# Altium schematic sheet Connector-Sheet.SchDoc
size A; DocumentNumber: 5; SheetNumber: 5; SheetTotal: 5
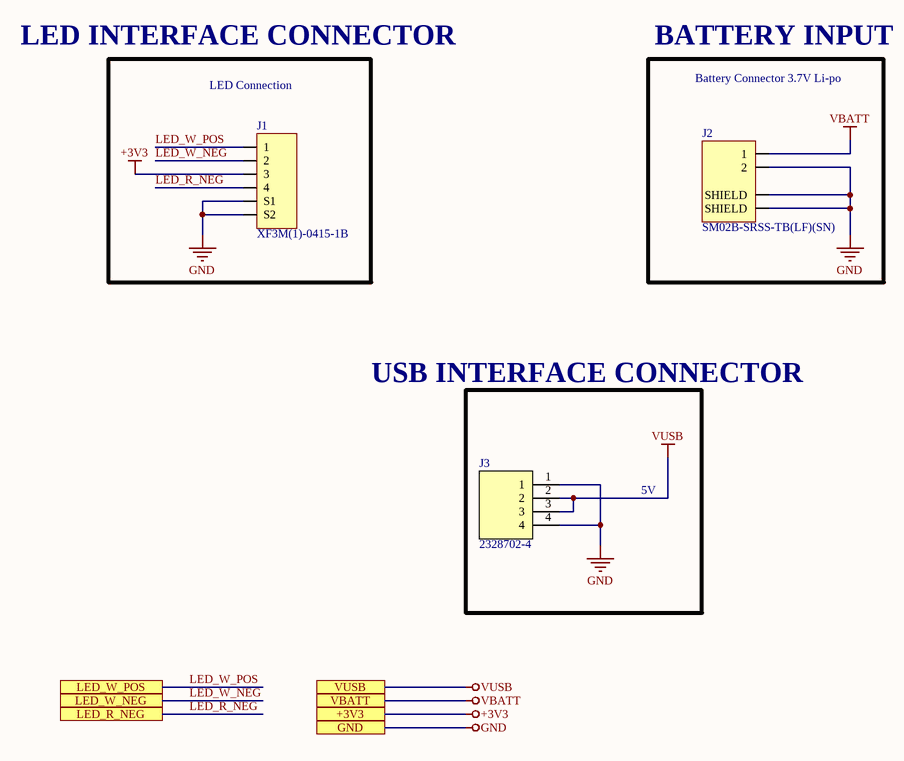
[diagram p0: Connector-Sheet.SchDoc]

## Parts
J1  XF3M(1)-0415-1B  [XF3M(1)-0415-1B]
J2  SM02B-SRSS-TB(LF)(SN)  [SM02B-SRSS-TB(LF)(SN)]
J3  2328702-4  [TE_2328702-4]

## Blocks framed on the sheet
LED Connection: J1
BATTERY INPUT: J2
5V: J3

## Ports
+3V3 (see Top-Sheet[1A], Controller-Sheet[2D], LED-Driver-Sheet[2D], Power-Sheet[2D]), GND (see Top-Sheet[1B], Controller-Sheet[2D], LED-Driver-Sheet[2D], Power-Sheet[2D]), LED_R_NEG (see Top-Sheet[2B], LED-Driver-Sheet[1D]), LED_W_NEG (see Top-Sheet[2B], LED-Driver-Sheet[1D]), LED_W_POS (see Top-Sheet[2B], LED-Driver-Sheet[1D]), VBATT (see Top-Sheet[1A], Controller-Sheet[2D], LED-Driver-Sheet[2D], Power-Sheet[2D]), VUSB (see Top-Sheet[1A], Power-Sheet[2D])

## Nets
+3V3: J1.3 ; port +3V3
GND: J1.S1 J1.S2 J2.2 J2.3(SHIELD) J2.4(SHIELD) J3.1 J3.4 ; port GND
VBATT: J2.1 ; port VBATT
VUSB: J3.2 J3.3 ; port VUSB
LED_R_NEG: J1.4 ; port LED_R_NEG
LED_W_NEG: J1.2 ; port LED_W_NEG
LED_W_POS: J1.1 ; port LED_W_POS

## Notes on the sheet
- LED INTERFACE CONNECTOR
- Battery Connector 3.7V Li-po
- USB INTERFACE CONNECTOR

## Library data of the parts
J1 = XF3M(1)-0415-1B: 4 Position FFC, FPC Connector Contacts, Top and Bottom 0.039" (1.00mm) Surface Mount, Right Angle; Manufacturer: Omron Electronics Inc-EMC Div; Item Type: FPC-1mm; Manufacturer Part Number: XF3M(1)-0415-1B; Digikey Part Number: OR1210CT-ND; ComponentLink1Description: Digikey Link; ComponentLink1URL: https://www.digikey.com/en/products/detail/omron-electronics-inc-emc-div/XF3M-1-0415-1B/4695932; Package: 1mm FPC
J2 = SM02B-SRSS-TB(LF)(SN): Connector Header Surface Mount, Right Angle 2 position 0.039 _1.00mm_; Manufacturer Part NUmber: SM02B-SRSS-TB_LF__SN_; Manufacturer: JST Sales; SnapEDA_Link: https://www.snapeda.com/parts/SM02B-SRSS-TB%28LF%29%28SN%29/JST%20Sales%20America%20Inc./view-part/447499/?ref=snap; Price: None; Value: *; Availability: Unavailable; Package: None; Digikey Part Number: 455-SM02B-SRSS-TBDKR-ND; ComponentLink1Description: Digikey Link; ComponentLink1URL: https://www.digikey.com/en/products/detail/jst-sales-america-inc/SM02B-SRSS-TB/926708?s=N4IgTCBcDaIMoFkAMYBCBaOAlOd0BVUQBdAXyA
J3 = 2328702-4: 4 Position FPC Connector Contacts, Top and Bottom 0.020 (0.50mm) Surface Mount, Right Angle; MF: TE Connectivity AMP Connectors; Package: None; Price: None; Check_prices: https://www.snapeda.com/parts/2328702-4/TE+Connectivity/view-part/?ref=eda; Value: *; SnapEDA_Link: https://www.snapeda.com/parts/2328702-4/TE+Connectivity/view-part/?ref=snap; MP: 2328702-4; Availability: In Stock; Purchase-URL: https://pricing.snapeda.com/search?q=2328702-4&ref=eda